# EAGLE board DotModuleArduinoMegaShield (EAGLE 9.1.3)
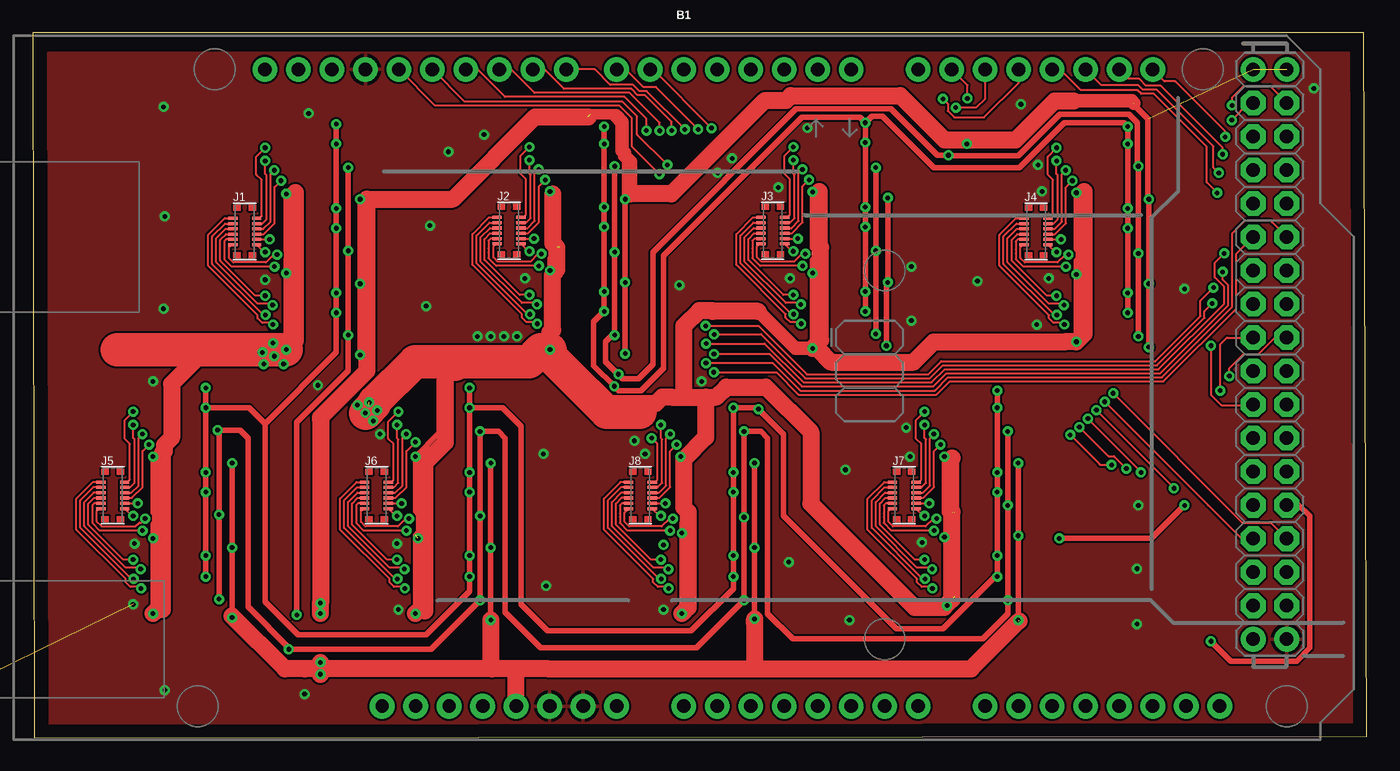
[diagram p2: board, top side]
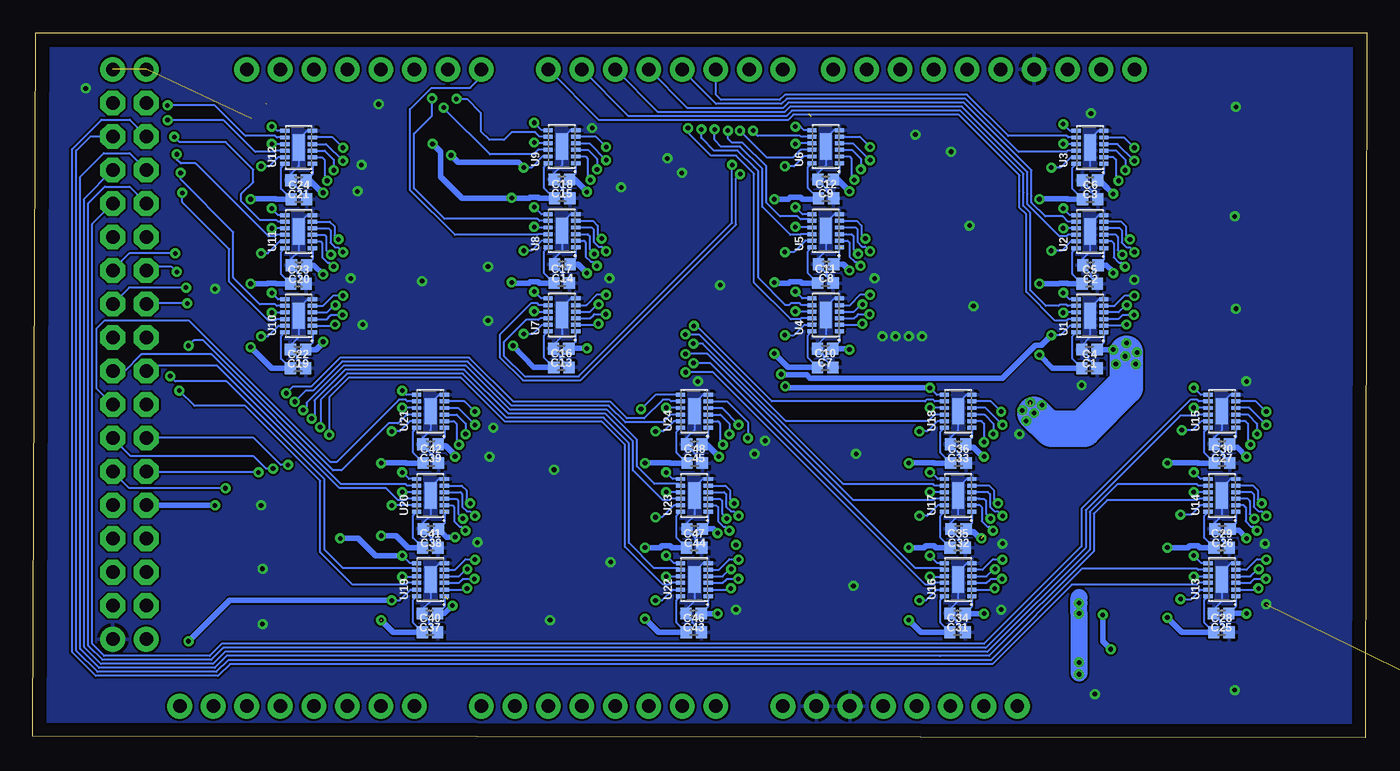
[diagram p3: board, bottom side, seen from below]

Size 101.1 x 53.4 mm. Coordinates in mm from the lower left corner, seen from the top.
Outline: 0.1,0 101.1,0.1 100.9,53.4 0,53.4 0.1,0
Copper layers (1*16): Top 0.035mm / dielectric 1.5mm / Bottom 0.035mm
Design rules "default": minimum track width 6mil, minimum drill 0.35mm, track to track 6mil, track to pad 6mil, pad to pad 6mil, via to via 6mil, smd to smd 6mil, copper to edge 40mil, drill to drill 6mil, minimum pad ring 10mil, minimum via ring 8mil, stop-mask expansion 4mil, vias tented up to drill 0mil, thermal gap 10mil

## Footprints (pad centres in the part's own frame; a part is rotated, then mirrored left to right if it is on the bottom)
ARDUINO_MEGA_NO_SILK = drill 1.016 pad 1.88: 0 13.97,24.13; 1 11.43,24.13; 2 8.89,24.13; 3 6.35,24.13; 3.3V -13.97,-24.13; 4 3.81,24.13; 5 1.27,24.13; 5V -11.43,-24.13; 5V@1 44.45,24.13; 5V@2 46.99,24.13; 6 -1.27,24.13; 7 -3.81,24.13; 8 -7.62,24.13; 9 -10.16,24.13; 10 -12.7,24.13; 11 -15.24,24.13; 12 -17.78,24.13; 13 -20.32,24.13; 14 19.05,24.13; 15 21.59,24.13; 16 24.13,24.13; 17 26.67,24.13; 18 29.21,24.13; 19 31.75,24.13; 20 34.29,24.13; 21 36.83,24.13; A0 1.27,-24.13; A1 3.81,-24.13; A2 6.35,-24.13; A3 8.89,-24.13; A4 11.43,-24.13; A5 13.97,-24.13; A6 16.51,-24.13; A7 19.05,-24.13; A8 24.13,-24.13; A9 26.67,-24.13; A10 29.21,-24.13; A11 31.75,-24.13; A12 34.29,-24.13; A13 36.83,-24.13; A14 39.37,-24.13; A15 41.91,-24.13; AREF -25.4,24.13; GND -8.89,-24.13; GND@1 -6.35,-24.13; GND@2 44.45,-19.05; GND@3 46.99,-19.05; GND@4 -22.86,24.13; IOREF -19.05,-24.13; NC -21.59,-24.13; RESET -16.51,-24.13; SCL -30.48,24.13; SDA -27.94,24.13; VIN -3.81,-24.13 | drill 1.016 pad 1.88 octagon: 22 44.45,21.59; 23 46.99,21.59; 24 44.45,19.05; 25 46.99,19.05; 26 44.45,16.51; 27 46.99,16.51; 28 44.45,13.97; 29 46.99,13.97; 30 44.45,11.43; 31 46.99,11.43; 32 44.45,8.89; 33 46.99,8.89; 34 44.45,6.35; 35 46.99,6.35; 36 44.45,3.81; 37 46.99,3.81; 38 44.45,1.27; 39 46.99,1.27; 40 44.45,-1.27; 41 46.99,-1.27; 42 44.45,-3.81; 43 46.99,-3.81; 44 44.45,-6.35; 45 46.99,-6.35; 46 44.45,-8.89; 47 46.99,-8.89; 48 44.45,-11.43; 49 46.99,-11.43; 50 44.45,-13.97; 51 46.99,-13.97; 52 44.45,-16.51; 53 46.99,-16.51
0402 = smd 0.85 x 0.9: 1 -0.58,0; 2 0.58,0
AXE612124-12PIN = smd 0.7 x 0.23: P1 -0.9,1; P2 -0.9,0.6; P3 -0.9,0.2; P4 -0.9,-0.2; P5 -0.9,-0.6; P6 -0.9,-1; P7 0.9,-1; P8 0.9,-0.6; P9 0.9,-0.2; P10 0.9,0.2; P11 0.9,0.6; P12 0.9,1
USB-B-MICRO-SMD_RED_PASTE = smd 1.45 x 0.4: D+ 2.725,0; D- 2.725,0.65; GND 2.725,-1.3; ID 2.725,-0.65; VBUS 2.725,1.3 | smd 1.5 x 1.8: SHIELD1 0,3.685; SHIELD2 0,-3.685 | smd 1.5 x 2.5: SHIELD3 0,0 | hole 0.85: 2.2,1.9; 2.2,-1.9
WSON-12 = smd 0.3 x 0.7: 1 -1.25,-1.05; 2 -0.75,-1.05; 3 -0.25,-1.05; 4 0.25,-1.05; 5 0.75,-1.05; 6 1.25,-1.05; 7 1.25,1.05; 8 0.75,1.05; 9 0.25,1.05; 10 -0.25,1.05; 11 -0.75,1.05; 12 -1.25,1.05 | smd 2 x 0.9: PAD 0,0

## Placement (x,y rotation side)
B1  ARDUINO_MEGA_R3FULL  [ARDUINO_MEGA_NO_SILK]  48.06,26.51 0 top
C1  0.1uF  [0402]  21.01,29.41 180 bottom
C2  0.1uF  [0402]  20.93,35.81 180 bottom
C3  0.1uF  [0402]  20.96,42.24 180 bottom
C4  0.1uF  [0402]  21,27.99 0 bottom
C5  0.1uF  [0402]  20.98,34.39 0 bottom
C6  0.1uF  [0402]  20.94,40.81 0 bottom
C7  0.1uF  [0402]  41.05,29.47 180 bottom
C8  0.1uF  [0402]  40.97,35.87 180 bottom
C9  0.1uF  [0402]  41,42.3 180 bottom
C10  0.1uF  [0402]  41.04,28.05 0 bottom
C11  0.1uF  [0402]  41.02,34.45 0 bottom
C12  0.1uF  [0402]  40.98,40.87 0 bottom
C13  0.1uF  [0402]  61.05,29.47 180 bottom
C14  0.1uF  [0402]  60.97,35.87 180 bottom
C15  0.1uF  [0402]  61,42.3 180 bottom
C16  0.1uF  [0402]  61.04,28.05 0 bottom
C17  0.1uF  [0402]  61.02,34.45 0 bottom
C18  0.1uF  [0402]  60.98,40.87 0 bottom
C19  0.1uF  [0402]  81.01,29.41 180 bottom
C20  0.1uF  [0402]  80.93,35.81 180 bottom
C21  0.1uF  [0402]  80.96,42.24 180 bottom
C22  0.1uF  [0402]  81,27.99 0 bottom
C23  0.1uF  [0402]  80.98,34.39 0 bottom
C24  0.1uF  [0402]  80.94,40.81 0 bottom
C25  0.1uF  [0402]  11.01,9.41 180 bottom
C26  0.1uF  [0402]  10.93,15.81 180 bottom
C27  0.1uF  [0402]  10.96,22.24 180 bottom
C28  0.1uF  [0402]  11,7.99 0 bottom
C29  0.1uF  [0402]  10.98,14.39 0 bottom
C30  0.1uF  [0402]  10.94,20.81 0 bottom
C31  0.1uF  [0402]  31.01,9.41 180 bottom
C32  0.1uF  [0402]  30.93,15.81 180 bottom
C33  0.1uF  [0402]  30.96,22.24 180 bottom
C34  0.1uF  [0402]  31,7.99 0 bottom
C35  0.1uF  [0402]  30.98,14.39 0 bottom
C36  0.1uF  [0402]  30.94,20.81 0 bottom
C37  0.1uF  [0402]  71.01,9.41 180 bottom
C38  0.1uF  [0402]  70.93,15.81 180 bottom
C39  0.1uF  [0402]  70.96,22.24 180 bottom
C40  0.1uF  [0402]  71,7.99 0 bottom
C41  0.1uF  [0402]  70.98,14.39 0 bottom
C42  0.1uF  [0402]  70.94,20.81 0 bottom
C43  0.1uF  [0402]  51.01,9.41 180 bottom
C44  0.1uF  [0402]  50.93,15.81 180 bottom
C45  0.1uF  [0402]  50.96,22.24 180 bottom
C46  0.1uF  [0402]  51,7.99 0 bottom
C47  0.1uF  [0402]  50.98,14.39 0 bottom
C48  0.1uF  [0402]  50.94,20.81 0 bottom
J1  AXE612124-12PIN  [AXE612124-12PIN]  16.05,38.36 0 top
J2  AXE612124-12PIN  [AXE612124-12PIN]  36.09,38.42 0 top
J3  AXE612124-12PIN  [AXE612124-12PIN]  56.09,38.42 0 top
J4  AXE612124-12PIN  [AXE612124-12PIN]  76.05,38.36 0 top
J5  AXE612124-12PIN  [AXE612124-12PIN]  6.05,18.36 0 top
J6  AXE612124-12PIN  [AXE612124-12PIN]  26.05,18.36 0 top
J7  AXE612124-12PIN  [AXE612124-12PIN]  66.05,18.36 0 top
J8  AXE612124-12PIN  [AXE612124-12PIN]  46.05,18.36 0 top
J9  [USB-B-MICRO-SMD_RED_PASTE]  -11.5,3.4 0 top  (outside the outline)
U1  DRV8835  [WSON-12]  20.96,31.97 90 bottom
U2  DRV8835  [WSON-12]  20.96,38.35 90 bottom
U3  DRV8835  [WSON-12]  20.96,44.73 90 bottom
U4  DRV8835  [WSON-12]  41,32.03 90 bottom
U5  DRV8835  [WSON-12]  41,38.41 90 bottom
U6  DRV8835  [WSON-12]  41,44.79 90 bottom
U7  DRV8835  [WSON-12]  61,32.03 90 bottom
U8  DRV8835  [WSON-12]  61,38.41 90 bottom
U9  DRV8835  [WSON-12]  61,44.79 90 bottom
U10  DRV8835  [WSON-12]  80.96,31.97 90 bottom
U11  DRV8835  [WSON-12]  80.96,38.35 90 bottom
U12  DRV8835  [WSON-12]  80.96,44.73 90 bottom
U13  DRV8835  [WSON-12]  10.96,11.97 90 bottom
U14  DRV8835  [WSON-12]  10.96,18.35 90 bottom
U15  DRV8835  [WSON-12]  10.96,24.73 90 bottom
U16  DRV8835  [WSON-12]  30.96,11.97 90 bottom
U17  DRV8835  [WSON-12]  30.96,18.35 90 bottom
U18  DRV8835  [WSON-12]  30.96,24.73 90 bottom
U19  DRV8835  [WSON-12]  70.96,11.97 90 bottom
U20  DRV8835  [WSON-12]  70.96,18.35 90 bottom
U21  DRV8835  [WSON-12]  70.96,24.73 90 bottom
U22  DRV8835  [WSON-12]  50.96,11.97 90 bottom
U23  DRV8835  [WSON-12]  50.96,18.35 90 bottom
U24  DRV8835  [WSON-12]  50.96,24.73 90 bottom

## Tracks (layer width: path | path; a pad name or v marks a point on that pad's centre or on a via)
D1.1
  Bottom 0.152: U1.10 22.62,31.72 22.75,31.59 23.62,31.59 25.8,33.77 25.8,39.65 26.32,40.17 26.32,41.43 26.31,41.44 26.31,42.6 30.92,47.21 43.45,47.21 43.86,46.8 58.19,46.8 B1.0
D1.2
  Bottom 0.152: U1.8 22.66,32.72 22.75,32.81 23.25,32.81 23.34,32.72 24.32,32.72 25.5,33.9 25.5,39.78 26.02,40.3 26.02,41.3 26.01,41.31 26.01,42.73 30.8,47.51 43.58,47.51 43.98,47.1 55.95,47.1 B1.1
D1.3
  Bottom 0.152: U2.10 22.64,38.1 22.75,37.99 23.28,37.99 25.71,40.42 25.71,41.18 25.71,42.85 30.67,47.82 43.7,47.82 44.11,47.41 53.72,47.41 B1.2
D1.4
  Bottom 0.152: U2.8 22.64,39.1 23.04,39.49 24.35,39.49 25.41,40.55 25.41,41.05 25.4,41.06 25.4,42.98 30.54,48.12 43.83,48.12 44.24,47.71 51.48,47.71 B1.3
D1.5
  Bottom 0.152: U3.10 22.66,44.48 22.75,44.39 26.38,44.39 30.42,48.43 43.96,48.43 44.36,48.02 49.3,48.02 51.87,50.59 B1.4
D1.6
  Bottom 0.152: U3.8 22.62,45.48 22.75,45.61 27.17,45.61 30.29,48.73 44.08,48.73 44.49,48.32 48.92,48.32 49.33,48.73 B1.5
D2.1  (via drill 0.35)
  Top 0.152: v51.44,46.19 47,50.64 B1.6
  Bottom 0.152: U4.10 42.86,31.78 42.95,31.69 43.65,31.69 46.42,34.46 46.42,42.72 47.8,44.1 49.69,44.1 51.44,45.85 v51.44,46.19
D2.2  (via drill 0.35)
  Top 0.152: B1.7 44.25,50.63 44.97,50.63 46.3,49.3 47.23,49.3 v50.44,46.1
  Bottom 0.152: U4.8 42.82,32.78 42.95,32.91 43.65,32.91 43.78,32.78 44.04,32.78 46.12,34.86 46.12,42.92 46.42,43.22 47.69,44.49 49.48,44.49 50.44,45.44 v50.44,46.1
D2.3  (via drill 0.35)
  Top 0.152: B1.8 42.6,50.64 43.77,49.47 45.5,49.47 45.98,48.99 46.53,48.99 v49.43,46.09
  Bottom 0.152: U5.10 42.88,38.16 42.95,38.09 43.68,38.09 45.81,40.22 45.81,43.11 47.49,44.79 48.93,44.79 49.43,45.29 v49.43,46.09
D2.4  (via drill 0.35)
  Top 0.152: B1.9 38.79,50.64 40.26,49.17 45.37,49.17 45.85,48.69 46.4,48.69 48.42,46.67 v48.42,46 48.42,46.12
  Bottom 0.152: U5.8 42.17,39.28 42.91,39.28 43.12,39.49 44.45,39.49 45.51,40.55 45.51,43.29 47.32,45.1 48.12,45.1 48.42,45.4 v48.42,46
D2.5  (via drill 0.35)
  Top 0.152: v47.51,45.99 47.51,46.6 45.25,48.86 38.03,48.86 36.25,50.64 B1.10
  Bottom 0.152: U6.10 42.9,44.54 43.45,43.99 45.51,43.99 v47.51,45.99
D2.6  (via drill 0.35)
  Top 0.152: 32.86,50.64 B1.11 33.71,50.64 35.79,48.56 44.84,48.56 46.5,46.9 v46.5,46
  Bottom 0.152: U6.8 42.88,45.54 42.95,45.61 46.17,45.61 46.5,45.94 v46.5,46
D3.1  (via drill 0.35)
  Top 0.152: v48.1,43.4 45.81,45.69 45.81,47.08 44.68,48.2 32.72,48.2 B1.12
  Bottom 0.152: v48.1,43.4 48.1,39 59.73,27.37 63.83,27.37 65.41,28.95 65.41,29.95 63.7,31.66 62.77,31.66 62.65,31.78 U7.10
D3.2  (via drill 0.35)
  Top 0.152: v47.49,42.7 45.41,44.79 45.41,46.95 44.46,47.9 30.48,47.9 B1.13
  Bottom 0.152: v47.49,42.7 47.8,42.4 47.8,38.87 59.6,27.07 63.96,27.07 65.71,28.82 65.71,30.55 63.35,32.91 62.85,32.91 62.72,32.78 U7.8
D3.3
  Bottom 0.152: U8.10 62.78,38.16 62.85,38.09 69.11,38.09 72.52,41.5 72.52,47.63 70.89,49.25 67.95,49.25 67.11,50.09 B1.14
D3.4  (via drill 0.35)
  Top 0.152: B1.15 70.84,49.45 v70.84,48.44
  Bottom 0.152: U8.8 62.7,39.16 62.85,39.31 69.9,39.31 72.21,41.62 72.21,45.78 70.84,47.15 v70.84,48.44
D3.5  (via drill 0.35)
  Top 0.152: B1.16 72.19,48.43 71.49,47.74 v69.96,47.74
  Bottom 0.152: U9.10 62.8,44.54 63.15,44.19 66.45,44.19 69.86,47.6 69.86,47.64 v69.96,47.74
D3.6  (via drill 0.35)
  Top 0.152: B1.17 74.73,49.63 72.1,47 69.84,47 69.35,47.49 69.35,48.05 v69,48.4
  Bottom 0.152: U9.8 62.68,45.54 63.04,45.89 64.81,45.89 65.4,45.3 66.5,45.3 67.15,45.95 | 67.15,45.95 67.09,45.89 | 67.15,45.95 67.15,47.35 68.2,48.4 v69,48.4
D4.1  (via drill 0.35)
  Top 0.152: B1.18 77.86,50.64 79.43,49.07 83.72,49.07 84.01,48.78 84.98,48.78 88.98,44.78 88.98,42.08 v89.78,41.28
  Bottom 0.152: U10.10 82.62,31.72 82.75,31.59 83.25,31.59 86.21,34.56 86.21,37.01 89.78,40.58 v89.78,41.28
D4.2  (via drill 0.35)
  Top 0.152: v89.9,42.8 89.5,43.2 89.5,44.8 85.2,49.1 84.13,49.1 83.8,49.44 81.01,49.44 B1.19
  Bottom 0.152: U10.8 82.61,32.72 82.73,32.84 83.9,32.84 85.91,34.85 85.91,38.31 89.9,42.3 v89.9,42.8
D4.3  (via drill 0.35)
  Top 0.152: v90.2,44.21 90.2,44.71 85.5,49.41 84.39,49.41 83.86,49.94 83.05,49.94 B1.20
  Bottom 0.152: U11.10 82.64,38.1 82.75,37.99 83.25,37.99 88.77,43.51 89.9,43.51 90.2,43.81 v90.2,44.21
D4.4  (via drill 0.35)
  Top 0.152: v90.38,45.52 90.38,45.95 86.59,49.74 85.79,49.74 B1.21
  Bottom 0.152: U11.8 82.51,39.1 82.63,39.22 83.88,39.22 85.3,40.64 85.3,41.2 84.4,42.1 84.4,43.04 86.48,45.12 89.98,45.12 v90.38,45.52
D4.5  (via drill 0.35)
  Top 0.152: v90.89,46.8 92.19,48.1 B1.22
  Bottom 0.152: U12.10 82.66,44.48 82.75,44.39 84.25,44.39 86.66,46.8 v90.89,46.8
D4.6  (via drill 0.35)
  Top 0.152: B1.23 93.75,49.4 91.8,49.4 90.9,48.5 v90.9,47.91
  Bottom 0.152: U12.8 82.62,45.48 82.75,45.61 85.01,45.61 87.31,47.91 v90.9,47.91
D5.1
  Bottom 0.152: U13.10 12.72,11.72 12.85,11.59 22.35,11.59 28.37,5.58 86.17,5.58 87.07,4.68 96.33,4.68 98.13,6.47 98.13,44.6 95.9,46.83 93.77,46.83 92.51,45.57 B1.24
D5.2
  Bottom 0.152: U13.8 12.76,12.72 12.85,12.81 21.57,12.81 28.5,5.88 86.29,5.88 87.19,4.98 96.21,4.98 97.82,6.6 97.82,44.48 96.74,45.56 B1.25
D5.3
  Bottom 0.152: U14.10 12.74,18.1 12.85,17.99 19.67,17.99 20.69,16.97 20.69,14.12 28.62,6.19 32.3,6.19 | 32.3,6.19 32.4,6.19 | 32.3,6.19 86.42,6.19 87.32,5.29 96.08,5.29 97.52,6.73 97.52,42.5 95.73,44.29 93.78,44.29 B1.26
D5.4
  Bottom 0.152: U14.8 12.74,19.1 12.85,19.21 18.88,19.21 20.99,17.1 20.99,14.25 28.75,6.49 86.55,6.49 87.45,5.59 95.95,5.59 97.21,6.85 97.21,40.86 B1.27
D5.5
  Bottom 0.152: U15.10 12.76,24.48 12.85,24.39 14.13,24.39 21.3,17.23 21.3,14.37 28.87,6.79 86.67,6.79 87.57,5.89 95.83,5.89 96.91,6.98 96.91,40.49 95.65,41.75 93.78,41.75 B1.28
D5.6
  Bottom 0.152: U15.8 12.72,25.48 12.85,25.61 13.35,25.61 21.6,17.36 21.6,14.5 29,7.1 86.8,7.1 87.7,6.2 95.7,6.2 96.6,7.11 96.6,38.92 B1.29
D6.1  (via drill 0.35)
  Top 0.152: v51.61,27.69 56.36,27.69 58.05,26 68.5,26 69.5,27 85.71,27 91.22,32.51 91.22,36.65 B1.30
  Bottom 0.152: U16.10 32.72,11.72 32.85,11.59 33.45,11.59 49.55,27.69 v51.61,27.69
D6.2  (via drill 0.35)
  Top 0.152: v51.02,28.38 51.02,28.39 56.08,28.39 58.17,26.3 68.37,26.3 69.37,27.3 85.59,27.3 90.92,32.64 90.92,38.22 91.9,39.2 93.79,39.2 93.94,39.05 | 93.88,39.11 93.94,39.05 | 93.94,39.05 B1.31
  Bottom 0.152: U16.8 32.13,12.84 34.2,12.84 49.74,28.38 v51.02,28.38
D6.3  (via drill 0.35)
  Top 0.152: v51.63,29.07 51.63,29.09 55.82,29.09 58.3,26.61 68.25,26.61 69.25,27.61 85.46,27.61 90.61,32.76 90.61,34.29 90.2,34.7 v90.2,35.3
  Bottom 0.152: U17.10 32.74,18.1 32.85,17.99 38.89,17.99 49.97,29.07 v51.63,29.07 | v90.2,35.3 90.6,35.7 92.21,35.7 B1.32
D6.4  (via drill 0.35)
  Top 0.152: v90.31,36.7 89.59,35.98 89.59,34.88 90.31,34.16 90.31,32.89 85.34,27.91 69.12,27.91 68.12,26.91 58.42,26.91 55.47,29.86 v51.04,29.86
  Bottom 0.152: U17.8 32.74,19.1 32.85,19.21 39.67,19.21 50.33,29.86 v51.04,29.86 | v90.31,36.7 93.8,36.7 95.05,35.45 B1.33
D6.5  (via drill 0.35)
  Top 0.152: v51.64,30.56 51.64,30.57 55.2,30.57 57.38,28.38 58.55,27.22 68,27.22 69,28.22 85.21,28.22 88.81,31.82 88.81,32.3 v89.4,32.9
  Bottom 0.152: U18.10 32.76,24.48 33.25,23.99 44.02,23.99 50.59,30.56 v51.64,30.56 | v89.4,32.9 92.47,32.9 B1.34
D6.6  (via drill 0.35)
  Top 0.152: v51,31.2 55,31.2 58.68,27.52 67.87,27.52 68.87,28.52 85.08,28.52 88.5,31.94 88.5,33.1 v89.5,34.1
  Bottom 0.152: U18.8 32.72,25.48 32.85,25.61 33.35,25.61 33.48,25.48 45.08,25.48 50.8,31.2 v51,31.2 | B1.35 93.81,34.1 v89.5,34.1
D7.1  (via drill 0.35)
  Top 0.152: v90,26.3 90,29.81 90.51,30.32 B1.36
  Bottom 0.152: U19.10 72.72,11.72 72.85,11.59 76.85,11.59 79.31,14.05 79.31,19.46 85,25.14 88.84,25.14 v90,26.3
D7.2  (via drill 0.35)
  Top 0.152: B1.37 94.16,30.32 92.89,29.05 91.75,29.05 90.7,28 v90.7,27.4
  Bottom 0.152: U19.8 72.13,12.84 77.6,12.84 79.01,14.25 79.01,19.58 86.42,27 90.3,27 v90.7,27.4
D7.3
  Bottom 0.152: U20.10 72.74,18.1 72.85,17.99 73.44,17.99 74.34,18.9 77.85,18.9 87.15,28.2 92.1,28.2 B1.38
D7.4
  Bottom 0.152: U20.8 72.74,19.1 72.85,19.21 77.73,19.21 87.57,29.05 92.89,29.05 94.16,27.78 B1.39
D7.5  (via drill 0.35)
  Top 0.152: B1.40 92.47,25.2 90.1,25.2 89.3,26 v89.3,29.7
  Bottom 0.152: U21.10 72.76,24.48 73.44,23.81 74.15,23.81 77.7,20.25 78.34,20.25 81.88,23.79 88.19,30.1 88.9,30.1 v89.3,29.7
D7.6
  Bottom 0.152: U21.8 72.72,25.48 72.85,25.61 73.35,25.61 78.08,20.88 78.54,20.88 89.25,31.59 95.71,31.59 96.3,31 96.3,26.49 B1.41
D8.1  (via drill 0.35)
  Top 0.152: v81.76,20.66 80.91,20.66 80.83,20.75 v78.64,22.94
  Bottom 0.152: U22.10 52.72,11.72 52.85,11.59 53.35,11.59 56.22,14.46 56.22,22.2 57.96,23.94 65.31,23.94 68.65,27.28 77.17,27.28 78.64,25.81 | 78.64,25.81 | 78.64,25.81 v78.64,22.94 | v81.76,20.66 82.31,20.66 84.38,22.73 92.48,22.73 B1.42
D8.2  (via drill 0.35)
  Top 0.152: v82.89,20.39 81.96,21.33 81.53,21.33 v79.33,23.53
  Bottom 0.152: U22.8 52.13,12.84 54,12.84 55.92,14.76 55.92,22.32 57.84,24.24 65.19,24.24 68.53,27.58 77.3,27.58 79.29,25.59 79.29,23.57 v79.33,23.53 | v82.89,20.39 83.44,20.39 84.37,21.33 93.68,21.33 B1.43
D8.3  (via drill 0.35)
  Top 0.152: v79.97,24.17 84,20.14 v84,20.1
  Bottom 0.152: U23.10 52.74,18.1 52.85,17.99 53.35,17.99 55.61,20.25 55.61,22.45 57.71,24.55 65.06,24.55 68.4,27.89 77.42,27.89 79.75,25.55 79.75,24.39 v79.97,24.17 | v84,20.1 92.45,20.1 B1.44
D8.4  (via drill 0.35)
  Top 0.152: v80.62,24.81 86.5,18.93 v86.5,18.9
  Bottom 0.152: U23.8 52.13,19.22 53.98,19.22 55.31,20.55 55.31,22.58 57.58,24.85 64.94,24.85 68.27,28.19 77.55,28.19 80.37,25.37 80.37,25.06 v80.62,24.81 | v86.5,18.9 93.79,18.9 B1.45
D8.5  (via drill 0.35)
  Top 0.152: v81.26,25.46 89.1,17.61 | 89.1,17.61 89.1,17.6 | 89.1,17.61 91.63,15.08 B1.48
  Bottom 0.152: U24.10 52.76,24.48 53.35,23.89 56.19,23.89 57.46,25.16 64.81,25.16 68.15,28.49 77.67,28.49 79.87,26.29 80.42,26.29 v81.26,25.46
D8.6  (via drill 0.35)
  Top 0.152: v81.9,26.1 91.7,16.3 93.83,16.3 B1.49
  Bottom 0.152: U24.8 52.72,25.48 52.85,25.61 53.35,25.61 54.76,24.2 56.07,24.2 57.33,25.46 64.68,25.46 68.02,28.8 77.8,28.8 80,26.6 81.4,26.6 v81.9,26.1
EN  (via drill 0.35)
  Top 0.406: v23,46.5 v23,45 v23,40.1 v23,38.6 v23,33.7 v23,32.2 23,29.2 17.6,23.8 | v13.1,26.5 v13.1,25 | v13.1,25 v13.1,20.1 v13.1,18.6 v13.1,13.8 v13.1,12.2 | v33.1,26.5 v33.1,25 | v33.1,25 v33.1,20.1 v33.1,18.6 v33.1,13.8 v33.1,12.2 33.1,11.1 29.8,7.8 20.1,7.8 17.6,10.3 17.6,23.8 | v43.3,46.3 v43.3,45 v43.3,40.2 v43.3,38.7 v43.3,33.8 v43.3,32.3 42.5,31.5 42.5,28.2 v44.07,26.63 44.4,26.3 46.1,26.3 47.8,28 47.8,36.5 58.3,47 62.7,47 v63.1,46.6 | v63.1,46.6 v63.1,45.1 v63.1,40.2 v63.1,38.7 v63.1,33.8 v63.1,32.3 | v73.1,26.3 v73.1,25 v73.1,20.1 v73.1,18.6 v73.1,13.8 v73.1,12.2 72.94,12.2 68.98,8.24 65.46,8.24 56.9,16.8 56.9,23 v55,24.9 54.9,25 v53.1,25 v53.1,20.1 v53.1,18.6 v53.1,13.8 v53.1,12.2 53.1,11.3 49.9,8.1 39,8.1 37,10.1 37,23.6 35.6,25 v33.1,25 | v83,32.2 v83,33.7 v83,38.6 v83,40.1 v83,45 v83,46.3 82.7,46.6 78.2,46.6 74.8,43.2 68.3,43.2 64.4,47.1 63.6,47.1 v63.1,46.6 | 17.6,23.8 16.4,25 v13.1,25 | v77.8,15.1 84.8,15.1 v87.3,17.6
  Bottom 0.152: U3.7 22.48,45.98 v23,46.5 | U3.9 22.98,44.98 v23,45 | U2.7 22.5,39.6 v23,40.1 | U2.9 v23,38.6 | U1.7 22.52,33.22 v23,33.7 | U1.9 22.98,32.22 v23,32.2 | U15.7 12.58,25.98 v13.1,26.5 | v13.1,12.2 13.08,12.22 U13.9 | U13.7 12.52,13.22 v13.1,13.8 | U14.7 12.6,19.6 v13.1,20.1 | U14.9 v13.1,18.6 | U15.9 13.08,24.98 v13.1,25 | U18.7 32.58,25.98 v33.1,26.5 | v33.1,12.2 32.03,12.2 U16.9 | U16.7 32.52,13.22 v33.1,13.8 | v33.1,20.1 33.01,20.1 32.51,19.6 U17.7 | U17.9 v33.1,18.6 | U18.9 33.08,24.98 v33.1,25 | U6.7 42.64,46.04 42.9,46.3 v43.3,46.3 | v43.3,32.3 42.07,32.3 U4.9 | U4.7 42.78,33.28 v43.3,33.8 | U5.7 42.76,39.66 v43.3,40.2 | U6.9 43.26,45.04 v43.3,45 | U5.9 43.26,38.66 v43.3,38.7 | U24.7 53.92,25.98 v55,24.9 | v53.1,12.2 53.08,12.22 U22.9 | U22.7 52.52,13.22 v53.1,13.8 | U23.9 v53.1,18.6 | U23.7 52.6,19.6 v53.1,20.1 | U24.9 53.08,24.98 v53.1,25 | U9.7 62.54,46.04 v63.1,46.6 | v63.1,38.7 63.06,38.66 U8.9 | U8.7 62.56,39.66 v63.1,40.2 | U9.9 63.04,45.04 v63.1,45.1 | v63.1,32.3 63.08,32.28 U7.9 | U7.7 62.58,33.28 v63.1,33.8 | U21.7 72.78,25.98 v73.1,26.3 | v73.1,12.2 72.03,12.2 U19.9 | U19.7 72.52,13.22 v73.1,13.8 | U20.9 v73.1,18.6 | U20.7 72.6,19.6 v73.1,20.1 | U21.9 73.08,24.98 v73.1,25 | U12.7 82.58,45.98 82.9,46.3 v83,46.3 | v83,32.2 82.98,32.22 U10.9 | U10.7 82.52,33.22 v83,33.7 | U11.7 82.5,39.6 v83,40.1 | U11.9 v83,38.6 | U12.9 82.98,44.98 v83,45
  Bottom 0.406: v33.1,26.5 43.84,26.5 43.97,26.63 v44.07,26.63 | v73.1,13.8 75.14,13.8 76.44,15.1 v77.8,15.1 | v87.3,17.6 92.49,17.6 B1.46
GND  (via drill 0.35)  (1 unrouted)
  Bottom 0.152: U6.6 40.36,46.04 41,45.4 U6.PAD 41,43.37 41.58,42.79 C9.2 41.58,42.22 40.91,41.54 40.91,41.38 C12.2 | U5.6 40.34,39.66 41,39 U5.PAD 41,36.89 41.55,36.34 C8.2 41.55,35.8 40.95,35.2 40.95,34.96 C11.2 | 40.85,32.76 40.85,32.55 | 40.85,32.76 40.85,32.18 U4.PAD 41,30.4 41.63,29.77 C7.2 41.12,28.96 41.12,28.76 40.46,28.1 C10.2 | 40,33.33 U4.6 40.33,33.28 40.85,32.76 | U24.6 50.32,25.98 50.96,25.34 U24.PAD 50.96,23.31 51.54,22.73 C45.2 51.54,22.16 50.87,21.48 50.87,21.32 C48.2 | U23.6 50.3,19.6 50.96,18.94 U23.PAD 50.96,16.83 51.51,16.28 C44.2 51.51,15.74 50.91,15.13 50.91,14.9 C47.2 | 50.81,12.7 50.81,12.49 | 50.81,12.7 50.81,12.12 U22.PAD 50.96,10.34 51.59,9.71 C43.2 51.08,8.9 51.08,8.7 50.42,8.04 C46.2 | 49.96,13.27 U22.6 50.29,13.22 50.81,12.7 | U3.6 20.32,45.98 20.96,45.34 U3.PAD 20.96,43.31 | U2.6 20.3,39.6 20.96,38.94 U2.PAD 20.96,36.83 21.51,36.28 C2.2 21.51,35.74 20.91,35.13 20.91,34.9 C5.2 | C6.2 20.87,41.32 20.87,41.48 21.54,42.16 C3.2 | 20.81,32.7 20.81,32.49 | 20.81,32.7 20.81,32.12 U1.PAD 20.96,30.34 21.59,29.71 C1.2 21.08,28.9 21.08,28.7 20.42,28.04 C4.2 | 19.96,33.27 U1.6 20.29,33.22 20.81,32.7 | U9.6 60.36,46.04 61,45.4 U9.PAD 61,43.37 61.58,42.79 C15.2 61.58,42.22 60.91,41.54 60.91,41.38 C18.2 | U8.6 60.34,39.66 61,39 U8.PAD 61,36.89 61.55,36.34 C14.2 61.55,35.8 60.95,35.2 60.95,34.96 C17.2 | 60.85,32.76 60.85,32.55 | 60.85,32.76 60.85,32.18 U7.PAD 61,30.4 61.63,29.77 C13.2 61.12,28.96 61.12,28.76 60.46,28.1 C16.2 | 60,33.33 U7.6 60.33,33.28 60.85,32.76 | U12.6 80.32,45.98 80.96,45.34 U12.PAD 80.96,43.31 81.54,42.73 C21.2 81.54,42.16 80.87,41.48 80.87,41.32 C24.2
  Bottom 0.152: U11.6 80.3,39.6 80.96,38.94 U11.PAD 80.96,36.83 81.51,36.28 C20.2 81.51,35.74 80.91,35.13 80.91,34.9 C23.2 | 80.81,32.7 80.81,32.49 | 80.81,32.7 80.81,32.12 U10.PAD 80.96,30.34 81.59,29.71 C19.2 81.08,28.9 81.08,28.7 80.42,28.04 C22.2 | 79.96,33.27 U10.6 80.29,33.22 80.81,32.7 | U15.6 10.32,25.98 10.96,25.34 U15.PAD 10.96,23.31 11.54,22.73 C27.2 11.54,22.16 10.87,21.48 10.87,21.32 C30.2 | U14.6 10.3,19.6 10.96,18.94 U14.PAD 10.96,16.83 11.51,16.28 C26.2 11.51,15.74 10.91,15.13 10.91,14.9 C29.2 | 10.81,12.7 10.81,12.49 | 10.81,12.7 10.81,12.12 U13.PAD 10.96,10.34 11.59,9.71 C25.2 11.08,8.9 11.08,8.7 10.42,8.04 C28.2 | 9.96,13.27 U13.6 10.29,13.22 10.81,12.7 | U18.6 30.32,25.98 30.96,25.34 U18.PAD 30.96,23.31 31.54,22.73 C33.2 31.54,22.16 30.87,21.48 30.87,21.32 C36.2 | U17.6 30.3,19.6 30.96,18.94 U17.PAD 30.96,16.83 31.51,16.28 C32.2 31.51,15.74 30.91,15.13 30.91,14.9 C35.2 | 30.81,12.7 30.81,12.49 | 30.81,12.7 30.81,12.12 U16.PAD 30.96,10.34 31.59,9.71 C31.2 31.08,8.9 31.08,8.7 30.42,8.04 C34.2 | 29.96,13.27 U16.6 30.29,13.22 30.81,12.7 | U21.6 70.32,25.98 70.96,25.34 U21.PAD 70.96,23.31 71.54,22.73 C39.2 71.54,22.16 70.87,21.48 70.87,21.32 C42.2 | U20.6 70.3,19.6 70.96,18.94 U20.PAD 70.96,16.83 71.51,16.28 C38.2 71.51,15.74 70.91,15.13 70.91,14.9 C41.2 | 70.81,12.7 70.81,12.49 | 70.81,12.7 70.81,12.12 U19.PAD 70.96,10.34 71.59,9.71 C37.2 71.08,8.9 71.08,8.69 70.93,8.54 70.93,8.5 C40.2 | U19.6 70.29,13.22 70.81,12.7
  other vias: 50.7,27 34.2,45.7 36.7,30.4 35.7,30.4 34.7,30.4 33.7,30.4 49,34.3 57.4,34.8 56.5,41.7 58.7,46.2 53,43.9 51.9,42.8 26.3,23 27.6,14.7 27.7,9.7 9.1,27 7.6,10.1 7.7,14.7 46.4,21.5 45.6,22.5 47.8,9.7 38.9,11.5 37.3,34.8 66.2,23.5 66.5,21.3 67.4,14.8 61.9,8.9 57.3,13.3 76.2,43.4 76.5,41.4 77,34.8 76.1,31.3 66.6,31.6 66.6,35.7 20.9,47.3 17.6,34.7 21.6,26.7 9.9,32.5 10,39.5 9.9,47.8 10,3.6 20.6,3.3 83.7,8.6 83.7,12.8 83.8,17.6 30.1,38.8 29.8,32.7 74.9,48 71.6,34.6 31.5,44.4 61.6,20.3 97.1,49.2 87.3,34 38.7,21.5
  pour Bottom: 1.1,52.4 1.1,1.1 100.1,1.1 100.1,52.4
  pour Top: 1.1,51.9 1.1,0.4 100.1,0.4 100.1,51.9
J1P1  (via drill 0.35)
  Top 0.152: v18.19,31.31 18.08,31.42 17.38,31.42 17.02,31.78 17.02,32.02 13.28,35.77 13.28,38.1 14.54,39.36 J1.P1
  Bottom 0.152: v18.19,31.31 18.28,31.22 U1.2
J1P2  (via drill 0.35)
  Top 0.152: J1.P2 14.57,38.96 13.59,37.98 13.59,35.89 17.45,32.03 v17.63,32.03
  Bottom 0.152: v17.63,32.03 18.49,32.03 18.8,31.72 U1.3
J1P3  (via drill 0.35)
  Top 0.152: v18.17,32.77 18.06,32.88 17.03,32.88 13.89,36.02 13.89,37.85 14.6,38.56 J1.P3
  Bottom 0.152: v18.17,32.77 18.26,32.77 18.81,32.22 U1.4
J1P4  (via drill 0.35)
  Top 0.152: J1.P4 14.63,38.16 14.2,37.73 14.2,36.14 16.85,33.49 v17.6,33.49
  Bottom 0.152: v17.6,33.49 17.63,33.52 18.31,33.52 19.11,32.72 U1.5
J1P5  (via drill 0.35)
  Top 0.152: v18.31,35.69 15.08,35.69 14.5,36.27 14.5,36.7 14.5,37 14.5,37.6 14.66,37.76 J1.P5
  Bottom 0.152: v18.31,35.69 18.61,36 18.76,36 19.16,36.4 19.16,37.46 19.3,37.6 U2.2
J1P6  (via drill 0.35)
  Top 0.152: v18.51,36.6 18.26,36.6 17.67,36.01 15.2,36.01 14.86,36.34 14.86,37.17 15.05,37.36 J1.P6
  Bottom 0.152: v18.51,36.6 18.86,36.95 18.86,37.9 18.86,37.96 19,38.1 U2.3
J1P7  (via drill 0.35)
  Top 0.152: J1.P7 17.51,36.8 v17.6,36.8
  Bottom 0.152: v17.6,36.8 17.95,37.15 18.2,37.15 18.55,37.5 18.55,38.45 18.7,38.6 U2.4
J1P8  (via drill 0.35)
  Top 0.152: J1.P8 v17.94,37.76 v17.95,37.75
  Bottom 0.152: v17.95,37.75 18.25,38.05 18.25,38.74 18.6,39.1 U2.5
J1P9  (via drill 0.35)
  Top 0.152: v18.8,42.2 18.31,41.71 18.31,38.98 17.49,38.16 J1.P9
  Bottom 0.152: v18.8,42.2 19,42.4 19,43.8 19.18,43.98 U3.2
J1P10  (via drill 0.35)
  Top 0.152: J1.P10 17.46,38.56 18.01,39.1 18.01,42.7 v18.3,43
  Bottom 0.152: v18.3,43 18.3,43.8 18.98,44.48 U3.3
J1P11  (via drill 0.35)
  Top 0.152: J1.P11 17.36,38.96 17.7,39.3 17.7,42.6 17.6,42.7 v17.6,43.7
  Bottom 0.152: v17.6,43.7 18.88,44.98 U3.4
J1P12  (via drill 0.35)
  Top 0.152: v17.6,44.7 16.94,44.04 16.94,42.66 17.34,42.26 17.34,39.55 17.15,39.36 J1.P12
  Bottom 0.152: v17.6,44.7 18.38,45.48 U3.5
J2P1  (via drill 0.35)
  Top 0.152: v38.23,31.37 38.12,31.48 37.42,31.48 37.06,31.84 37.06,32.09 33.32,35.83 33.32,38.16 34.58,39.42 J2.P1
  Bottom 0.152: U4.2 38.23,31.28 v38.23,31.37
J2P2  (via drill 0.35)
  Top 0.152: J2.P2 34.61,39.02 33.63,38.04 33.63,35.95 37.49,32.09 v37.67,32.09
  Bottom 0.152: U4.3 38.85,31.78 38.61,32.02 38.6,32.02 38.53,32.09 v37.67,32.09
J2P3  (via drill 0.35)
  Top 0.152: v38.21,32.83 38.1,32.94 37.07,32.94 33.93,36.08 33.93,37.91 34.64,38.62 J2.P3
  Bottom 0.152: U4.4 38.85,32.28 38.3,32.83 v38.21,32.83
J2P4  (via drill 0.35)
  Top 0.152: J2.P4 34.67,38.22 34.23,37.79 34.23,36.2 36.89,33.55 v37.64,33.55
  Bottom 0.152: v37.64,33.55 37.67,33.58 38.35,33.58 39.15,32.78 U4.5
J2P5  (via drill 0.35)
  Top 0.152: v38.35,35.75 35.12,35.75 34.54,36.33 34.54,36.76 34.54,37.06 34.54,37.66 34.7,37.82 J2.P5
  Bottom 0.152: U5.2 39.34,37.66 39.2,37.52 39.2,36.46 38.8,36.06 38.65,36.06 v38.35,35.75
J2P6  (via drill 0.35)
  Top 0.152: v38.55,36.66 38.3,36.66 37.7,36.07 35.23,36.07 34.9,36.4 34.9,37.23 35.09,37.42 J2.P6
  Bottom 0.152: U5.3 39.44,38.16 39.04,38.16 38.9,38.02 38.9,37.96 38.9,37.01 v38.55,36.66
J2P7  (via drill 0.35)
  Top 0.152: J2.P7 37.55,36.86 v37.64,36.86
  Bottom 0.152: U5.4 38.74,38.66 38.59,38.51 38.59,37.56 38.24,37.21 37.99,37.21 v37.64,36.86
J2P8  (via drill 0.35)
  Top 0.152: J2.P8 v37.98,37.82 v37.98,37.81
  Bottom 0.152: U5.5 38.64,39.16 38.28,38.8 38.28,38.12 v37.98,37.81
J2P9  (via drill 0.35)
  Top 0.152: v38.84,42.26 38.35,41.77 38.35,39.04 37.53,38.22 J2.P9
  Bottom 0.152: U6.2 39.22,44.04 39.04,43.86 39.04,42.46 v38.84,42.26
J2P10  (via drill 0.35)
  Top 0.152: J2.P10 37.5,38.62 38.05,39.16 38.05,42.77 v38.34,43.06
  Bottom 0.152: U6.3 39.02,44.54 38.34,43.86 v38.34,43.06
J2P11  (via drill 0.35)
  Top 0.152: J2.P11 37.4,39.02 37.74,39.36 37.74,42.66 37.64,42.76 v37.64,43.76
  Bottom 0.152: v37.64,43.76 38.92,45.04 U6.4
J2P12  (via drill 0.35)
  Top 0.152: v37.64,44.76 36.98,44.1 36.98,42.72 37.38,42.32 37.38,39.61 37.19,39.42 J2.P12
  Bottom 0.152: U6.5 39.54,45.54 38.42,45.54 v37.64,44.76
J3P1  (via drill 0.35)
  Top 0.152: v58.23,31.37 58.12,31.48 57.42,31.48 57.06,31.84 57.06,32.09 53.32,35.83 53.32,38.16 54.58,39.42 J3.P1
  Bottom 0.152: U7.2 58.32,31.28 v58.23,31.37
J3P2  (via drill 0.35)
  Top 0.152: J3.P2 54.61,39.02 53.63,38.04 53.63,35.95 57.49,32.09 v57.67,32.09
  Bottom 0.152: v57.67,32.09 58.53,32.09 58.6,32.02 58.61,32.02 58.85,31.78 U7.3
J3P3  (via drill 0.35)
  Top 0.152: v58.21,32.83 58.1,32.94 57.07,32.94 53.93,36.08 53.93,37.91 54.64,38.62 J3.P3
  Bottom 0.152: v58.21,32.83 58.3,32.83 58.85,32.28 U7.4
J3P4  (via drill 0.35)
  Top 0.152: J3.P4 54.67,38.22 54.23,37.79 54.23,36.2 56.89,33.55 v57.64,33.55
  Bottom 0.152: v57.64,33.55 57.67,33.58 58.35,33.58 59.15,32.78 U7.5
J3P5  (via drill 0.35)
  Top 0.152: v58.35,35.75 55.12,35.75 54.54,36.33 54.54,36.76 54.54,37.06 54.54,37.66 54.7,37.82 J3.P5
  Bottom 0.152: v58.35,35.75 58.65,36.06 58.8,36.06 59.2,36.46 59.2,37.52 59.34,37.66 U8.2
J3P6  (via drill 0.35)
  Top 0.152: v58.55,36.66 58.3,36.66 57.7,36.07 55.23,36.07 54.9,36.4 54.9,37.23 55.09,37.42 J3.P6
  Bottom 0.152: v58.55,36.66 58.9,37.01 58.9,37.96 58.9,38.02 59.04,38.16 U8.3
J3P7  (via drill 0.35)
  Top 0.152: J3.P7 57.55,36.86 v57.64,36.86
  Bottom 0.152: v57.64,36.86 57.99,37.21 58.24,37.21 58.59,37.56 58.59,38.51 58.74,38.66 U8.4
J3P8  (via drill 0.35)
  Top 0.152: J3.P8 v57.98,37.82 v57.98,37.81
  Bottom 0.152: v57.98,37.81 58.29,38.12 58.29,38.8 58.64,39.16 U8.5
J3P9  (via drill 0.35)
  Top 0.152: v58.84,42.26 58.35,41.77 58.35,39.04 57.53,38.22 J3.P9
  Bottom 0.152: v58.84,42.26 59.04,42.46 59.04,43.86 59.22,44.04 U9.2
J3P10  (via drill 0.35)
  Top 0.152: J3.P10 57.5,38.62 58.05,39.16 58.05,42.77 v58.34,43.06
  Bottom 0.152: v58.34,43.06 58.34,43.86 59.02,44.54 U9.3
J3P11  (via drill 0.35)
  Top 0.152: J3.P11 57.4,39.02 57.74,39.36 57.74,42.66 57.64,42.76 v57.64,43.76
  Bottom 0.152: v57.64,43.76 58.92,45.04 U9.4
J3P12  (via drill 0.35)
  Top 0.152: v57.64,44.76 56.98,44.1 56.98,42.72 57.38,42.32 57.38,39.61 57.19,39.42 J3.P12
  Bottom 0.152: v57.64,44.76 58.42,45.54 U9.5
J4P1  (via drill 0.35)
  Top 0.152: v78.19,31.31 78.08,31.42 77.38,31.42 77.02,31.78 77.02,32.02 73.28,35.77 73.28,38.1 74.54,39.36 J4.P1
  Bottom 0.152: v78.19,31.31 78.19,31.22 U10.2
J4P2  (via drill 0.35)
  Top 0.152: J4.P2 74.57,38.96 73.59,37.98 73.59,35.89 77.45,32.03 v77.63,32.03
  Bottom 0.152: v77.63,32.03 78.49,32.03 78.56,31.96 78.57,31.96 78.81,31.72 U10.3
J4P3  (via drill 0.35)
  Top 0.152: v78.17,32.77 78.06,32.88 77.03,32.88 73.89,36.02 73.89,37.85 74.6,38.56 J4.P3
  Bottom 0.152: v78.17,32.77 78.26,32.77 78.81,32.22 U10.4
J4P4  (via drill 0.35)
  Top 0.152: J4.P4 74.63,38.16 74.19,37.73 74.19,36.14 76.85,33.49 v77.6,33.49
  Bottom 0.152: v77.6,33.49 77.63,33.52 78.31,33.52 79.11,32.72 U10.5
J4P5  (via drill 0.35)
  Top 0.152: v78.31,35.69 75.08,35.69 74.5,36.27 74.5,36.7 74.5,37 74.5,37.6 74.66,37.76 J4.P5
  Bottom 0.152: v78.31,35.69 78.61,36 78.76,36 79.16,36.4 79.16,37.46 79.3,37.6 U11.2
J4P6  (via drill 0.35)
  Top 0.152: v78.51,36.6 78.26,36.6 77.66,36.01 75.19,36.01 74.86,36.34 74.86,37.17 75.05,37.36 J4.P6
  Bottom 0.152: v78.51,36.6 78.86,36.95 78.86,37.9 78.86,37.96 79,38.1 U11.3
J4P7  (via drill 0.35)
  Top 0.152: J4.P7 77.51,36.8 v77.6,36.8
  Bottom 0.152: v77.6,36.8 77.95,37.15 78.2,37.15 78.55,37.5 78.55,38.45 78.7,38.6 U11.4
J4P8  (via drill 0.35)
  Top 0.152: J4.P8 v77.94,37.76 v77.94,37.75
  Bottom 0.152: v77.94,37.75 78.25,38.05 78.25,38.74 78.6,39.1 U11.5
J4P9  (via drill 0.35)
  Top 0.152: v78.8,42.2 78.31,41.71 78.31,38.98 77.49,38.16 J4.P9
  Bottom 0.152: v78.8,42.2 79,42.4 79,43.8 79.18,43.98 U12.2
J4P10  (via drill 0.35)
  Top 0.152: J4.P10 77.46,38.56 78,39.1 78,42.7 v78.3,43
  Bottom 0.152: v78.3,43 78.3,43.8 78.98,44.48 U12.3
J4P11  (via drill 0.35)
  Top 0.152: J4.P11 77.36,38.96 77.7,39.3 77.7,42.6 77.6,42.7 v77.6,43.7
  Bottom 0.152: v77.6,43.7 78.88,44.98 U12.4
J4P12  (via drill 0.35)
  Top 0.152: v77.6,44.7 76.94,44.04 76.94,42.66 77.34,42.26 77.34,39.55 77.15,39.36 J4.P12
  Bottom 0.152: v77.6,44.7 78.38,45.48 U12.5
J5P1  (via drill 0.35)
  Top 0.152: v8.19,11.31 8.08,11.42 7.38,11.42 7.02,11.78 7.02,12.03 3.28,15.77 3.28,18.11 4.54,19.36 J5.P1
  Bottom 0.152: U13.2 8.19,11.22 v8.19,11.31
J5P2  (via drill 0.35)
  Top 0.152: v7.63,12.03 7.45,12.03 3.59,15.89 3.59,17.98 4.57,18.96 J5.P2
  Bottom 0.152: U13.3 8.8,11.72 8.49,12.03 v7.63,12.03
J5P3  (via drill 0.35)
  Top 0.152: v8.17,12.77 8.06,12.88 7.03,12.88 3.89,16.02 3.89,17.85 4.6,18.56 J5.P3
  Bottom 0.152: U13.4 8.81,12.22 8.26,12.77 v8.17,12.77
J5P4  (via drill 0.35)
  Top 0.152: J5.P4 4.63,18.16 4.2,17.73 4.2,16.14 6.85,13.49 v7.6,13.49
  Bottom 0.152: v7.6,13.49 7.63,13.52 8.31,13.52 9.11,12.72 U13.5
J5P5  (via drill 0.35)
  Top 0.152: v8.31,15.69 5.08,15.69 4.5,16.27 4.5,16.7 4.5,17 4.5,17.6 4.66,17.76 J5.P5
  Bottom 0.152: v8.31,15.69 8.61,16 8.76,16 9.16,16.4 9.16,17.46 9.25,17.55 9.3,17.6 U14.2
J5P6  (via drill 0.35)
  Top 0.152: v8.51,16.6 8.21,16.3 8.06,16.3 7.76,16 5.2,16 4.81,16.4 4.81,17.11 5.05,17.36 J5.P6
  Bottom 0.152: v8.51,16.6 8.86,16.95 8.86,17.9 8.86,17.96 9,18.1 U14.3
J5P7  (via drill 0.35)
  Top 0.152: J5.P7 7.51,16.8 v7.6,16.8
  Bottom 0.152: v7.6,16.8 7.95,17.15 8.2,17.15 8.55,17.5 8.55,18.45 8.7,18.6 U14.4
J5P8  (via drill 0.35)
  Top 0.152: J5.P8 v7.94,17.76 v7.95,17.75
  Bottom 0.152: v7.95,17.75 8.25,18.05 8.25,18.75 8.6,19.1 U14.5
J5P9  (via drill 0.35)
  Top 0.152: v8.8,22.2 8.31,21.71 8.31,18.98 7.49,18.16 J5.P9
  Bottom 0.152: v8.8,22.2 9,22.4 9,23.8 9.18,23.98 U15.2
J5P10  (via drill 0.35)
  Top 0.152: J5.P10 7.46,18.56 8.01,19.11 8.01,22.7 v8.3,23
  Bottom 0.152: v8.3,23 8.3,23.8 8.98,24.48 U15.3
J5P11  (via drill 0.35)
  Top 0.152: J5.P11 7.36,18.96 7.7,19.3 7.7,22.6 7.6,22.7 v7.6,23.7
  Bottom 0.152: v7.6,23.7 8.85,24.95 8.88,24.98 U15.4
J5P12  (via drill 0.35)
  Top 0.152: v7.6,24.7 6.94,24.04 6.94,22.66 7.34,22.26 7.34,19.55 7.15,19.36 J5.P12
  Bottom 0.152: v7.6,24.7 8.38,25.48 U15.5
J6P1  (via drill 0.35)
  Top 0.152: v28.19,11.31 28.08,11.42 27.38,11.42 27.02,11.78 27.02,12.03 23.28,15.77 23.28,18.11 24.54,19.36 J6.P1
  Bottom 0.152: v28.19,11.31 28.19,11.22 U16.2
J6P2  (via drill 0.35)
  Top 0.152: J6.P2 24.57,18.96 23.59,17.98 23.59,15.89 27.45,12.03 v27.63,12.03
  Bottom 0.152: v27.63,12.03 28.49,12.03 28.56,11.96 28.57,11.96 28.81,11.72 U16.3
J6P3  (via drill 0.35)
  Top 0.152: v28.17,12.77 28.06,12.88 27.03,12.88 23.89,16.02 23.89,17.85 24.6,18.56 J6.P3
  Bottom 0.152: v28.17,12.77 28.26,12.77 28.81,12.22 U16.4
J6P4  (via drill 0.35)
  Top 0.152: J6.P4 24.63,18.16 24.2,17.73 24.2,16.14 26.85,13.49 v27.6,13.49
  Bottom 0.152: v27.6,13.49 27.63,13.52 28.31,13.52 29.11,12.72 U16.5
J6P5  (via drill 0.35)
  Top 0.152: v28.31,15.69 25.08,15.69 24.5,16.27 24.5,16.7 24.5,17 24.5,17.6 24.66,17.76 J6.P5
  Bottom 0.152: v28.31,15.69 28.61,16 28.76,16 29.16,16.4 29.16,17.46 29.3,17.6 U17.2
J6P6  (via drill 0.35)
  Top 0.152: v28.51,16.6 28.26,16.6 27.66,16.01 25.2,16.01 24.86,16.34 24.86,17.17 25.05,17.36 J6.P6
  Bottom 0.152: 29.4,18.1 29.3,18.1 | 29.3,18.1 29,18.1 28.86,17.96 28.86,17.9 28.86,16.95 v28.51,16.6 | 29.3,18.1 U17.3
J6P7  (via drill 0.35)
  Top 0.152: J6.P7 27.51,16.8 v27.6,16.8
  Bottom 0.152: v27.6,16.8 27.95,17.15 28.2,17.15 28.55,17.5 28.55,18.45 28.7,18.6 U17.4
J6P8  (via drill 0.35)
  Top 0.152: J6.P8 v27.94,17.76 v27.95,17.75
  Bottom 0.152: v27.95,17.75 28.25,18.05 28.25,18.75 28.6,19.1 U17.5
J6P9  (via drill 0.35)
  Top 0.152: v29,22.4 28.31,21.71 28.31,18.98 27.49,18.16 J6.P9
  Bottom 0.152: v29,22.4 29,23.8 29.18,23.98 U18.2
J6P10  (via drill 0.35)
  Top 0.152: J6.P10 27.46,18.56 28.01,19.11 28.01,22.7 v28.3,23
  Bottom 0.152: v28.3,23 28.3,23.8 28.95,24.45 28.98,24.48 U18.3
J6P11  (via drill 0.35)
  Top 0.152: J6.P11 27.36,18.96 27.7,19.3 27.7,22.6 27.6,22.7 v27.6,23.7
  Bottom 0.152: v27.6,23.7 28.85,24.95 28.88,24.98 U18.4
J6P12  (via drill 0.35)
  Top 0.152: v27.7,24.7 26.94,23.94 26.94,22.66 27.34,22.26 27.34,19.55 27.15,19.36 J6.P12
  Bottom 0.152: v27.7,24.7 28.48,25.48 U18.5
J7P1  (via drill 0.35)
  Top 0.152: v68.19,11.31 68.08,11.42 67.38,11.42 67.02,11.78 67.02,12.03 63.28,15.77 63.28,18.11 64.54,19.36 J7.P1
  Bottom 0.152: v68.19,11.31 68.19,11.22 U19.2
J7P2  (via drill 0.35)
  Top 0.152: J7.P2 64.57,18.96 63.59,17.98 63.59,15.89 67.45,12.03 v67.63,12.03
  Bottom 0.152: v67.63,12.03 68.49,12.03 68.56,11.96 68.57,11.96 68.81,11.72 U19.3
J7P3  (via drill 0.35)
  Top 0.152: v68.17,12.77 68.06,12.88 67.03,12.88 63.89,16.02 63.89,17.85 64.6,18.56 J7.P3
  Bottom 0.152: v68.17,12.77 68.26,12.77 68.81,12.22 U19.4
J7P4  (via drill 0.35)
  Top 0.152: J7.P4 64.63,18.16 64.19,17.73 64.19,16.14 66.85,13.49 v67.6,13.49
  Bottom 0.152: v67.6,13.49 67.63,13.52 68.31,13.52 69.11,12.72 U19.5
J7P5  (via drill 0.35)
  Top 0.152: v68.31,15.69 65.08,15.69 64.5,16.27 64.5,16.7 64.5,17 64.5,17.6 64.66,17.76 J7.P5
  Bottom 0.152: v68.31,15.69 68.61,16 68.76,16 69.16,16.4 69.16,17.46 69.3,17.6 U20.2
J7P6  (via drill 0.35)
  Top 0.152: v68.51,16.6 68.26,16.6 67.66,16.01 65.19,16.01 64.86,16.34 64.86,17.17 65.05,17.36 J7.P6
  Bottom 0.152: v68.51,16.6 68.86,16.95 68.86,17.9 68.86,17.96 69,18.1 U20.3
J7P7  (via drill 0.35)
  Top 0.152: J7.P7 67.51,16.8 v67.6,16.8
  Bottom 0.152: v67.6,16.8 67.95,17.15 68.2,17.15 68.55,17.5 68.55,18.45 68.7,18.6 U20.4
J7P8  (via drill 0.35)
  Top 0.152: J7.P8 v67.94,17.76 v67.94,17.75
  Bottom 0.152: v67.94,17.75 68.25,18.05 68.25,18.75 68.6,19.1 U20.5
J7P9  (via drill 0.35)
  Top 0.152: v68.8,22.2 68.31,21.71 68.31,18.98 67.49,18.16 J7.P9
  Bottom 0.152: v68.8,22.2 69,22.4 69,23.8 69.18,23.98 U21.2
J7P10  (via drill 0.35)
  Top 0.152: J7.P10 67.46,18.56 68,19.11 68,22.7 v68.3,23
  Bottom 0.152: v68.3,23 68.3,23.8 68.98,24.48 U21.3
J7P11  (via drill 0.35)
  Top 0.152: J7.P11 67.36,18.96 67.7,19.3 67.7,22.6 67.6,22.7 v67.6,23.7
  Bottom 0.152: v67.6,23.7 68.88,24.98 U21.4
J7P12  (via drill 0.35)
  Top 0.152: v67.6,24.7 66.94,24.04 66.94,22.66 67.34,22.26 67.34,19.55 67.15,19.36 J7.P12
  Bottom 0.152: v67.6,24.7 68.38,25.48 U21.5
J8P1  (via drill 0.35)
  Top 0.152: v48.19,11.31 48.08,11.42 47.38,11.42 47.02,11.78 47.02,12.03 43.28,15.77 43.28,18.11 44.54,19.36 J8.P1
  Bottom 0.152: U22.2 48.19,11.22 v48.19,11.31
J8P2  (via drill 0.35)
  Top 0.152: v47.63,12.03 47.45,12.03 43.59,15.89 43.59,17.98 44.57,18.96 J8.P2
  Bottom 0.152: U22.3 48.81,11.72 48.57,11.96 48.56,11.96 48.49,12.03 v47.63,12.03
J8P3  (via drill 0.35)
  Top 0.152: v48.17,12.77 48.06,12.88 47.03,12.88 43.89,16.02 43.89,17.85 44.6,18.56 J8.P3
  Bottom 0.152: U22.4 48.81,12.22 48.26,12.77 v48.17,12.77
J8P4  (via drill 0.35)
  Top 0.152: v47.6,13.49 46.85,13.49 44.2,16.14 44.2,17.73 44.63,18.16 J8.P4
  Bottom 0.152: v47.6,13.49 47.63,13.52 48.31,13.52 49.11,12.72 U22.5
J8P5  (via drill 0.35)
  Top 0.152: v48.31,15.69 45.08,15.69 44.5,16.27 44.5,16.7 44.5,17 44.5,17.6 44.66,17.76 J8.P5
  Bottom 0.152: U23.2 49.3,17.6 49.16,17.46 49.16,16.4 48.76,16 48.61,16 v48.31,15.69
J8P6  (via drill 0.35)
  Top 0.152: v48.51,16.6 48.26,16.6 47.67,16.01 45.2,16.01 44.86,16.34 44.86,17.07 J8.P6
  Bottom 0.152: U23.3 49.4,18.1 49,18.1 48.86,17.96 48.86,17.9 48.86,16.95 v48.51,16.6
J8P7  (via drill 0.35)
  Top 0.152: v47.6,16.8 47.51,16.8 J8.P7
  Bottom 0.152: U23.4 48.7,18.6 48.55,18.45 48.55,17.5 48.2,17.15 47.95,17.15 v47.6,16.8
J8P8  (via drill 0.35)
  Top 0.152: v47.95,17.75 v47.94,17.76 J8.P8
  Bottom 0.152: U23.5 48.6,19.1 48.25,18.75 48.25,18.05 v47.95,17.75
J8P9  (via drill 0.35)
  Top 0.152: v48.8,22.2 48.31,21.71 48.31,18.98 47.49,18.16 J8.P9
  Bottom 0.152: U24.2 49.18,23.98 49,23.8 49,22.4 v48.8,22.2
J8P10  (via drill 0.35)
  Top 0.152: v48.3,23 48.01,22.7 48.01,19.11 47.46,18.56 J8.P10
  Bottom 0.152: U24.3 48.98,24.48 48.3,23.8 v48.3,23
J8P11  (via drill 0.35)
  Top 0.152: v47.6,23.7 47.6,22.7 47.7,22.6 47.7,19.3 47.36,18.96 J8.P11
  Bottom 0.152: v47.6,23.7 48.88,24.98 U24.4
J8P12  (via drill 0.35)
  Top 0.152: v46.9,22.7 46.94,22.66 47.34,22.26 47.34,19.55 47.15,19.36 J8.P12
  Bottom 0.152: U24.5 48.48,25.48 46.9,23.9 v46.9,22.7
MODE  (via drill 0.35)
  Top 0.406: v23.9,43.2 v23.9,36.9 v23.9,30.5 23.9,27.8 20,23.9 v20,9.3 | v14.1,10.5 v14.1,16.9 14.1,23.2 v14,23.3 15.7,23.3 16.3,22.7 16.3,9.9 19.5,6.7 v19.4,6.7 30.2,6.7 v33.9,10.4 v33.9,16.8 v33.9,23.2 35.3,23.2 35.8,22.7 35.8,9.5 38.5,6.8 50.3,6.8 v53.9,10.4 v53.9,16.7 v53.9,23.2 55.2,23.2 55.7,22.7 55.7,9.4 57.6,7.5 72,7.5 73.9,9.4 v73.9,10.4 v73.9,17.6 v73.9,23.2 | v44.1,43.3 v44.1,36.8 44.1,30.7 | 44.1,30.7 v44.1,30.5 | v63.9,43.2 v63.9,36.9 v63.9,30.6 | v83.8,30.4 v83.8,36.7 v83.8,43.3 83.73,43.37 83.73,46.6 83.08,47.26 77.87,47.26 74.71,44.1 69.43,44.1 v69.4,44.13 68.57,44.13 65.04,47.66 57.86,47.66 47,36.8 47,28.3 45.9,27.2 44.7,27.2 44.5,27.4 | 44.5,27.4 43.4,28.5 43.4,30 44.1,30.7 | 44.5,27.4 44.5,27.41 v44.38,27.54 | v89.3,7.3 90.8,5.8 95.8,5.8 96.8,6.8 96.8,16.8 95.98,17.62 B1.47
  Bottom 0.152: U3.11 22.42,43.98 23.2,43.2 v23.9,43.2 | U2.11 22.4,37.6 23.1,36.9 v23.9,36.9 | U1.11 22.48,31.22 23.2,30.5 v23.9,30.5 | U15.11 12.52,23.98 13.2,23.3 v14,23.3 | U13.11 12.58,11.22 13.3,10.5 v14.1,10.5 | U14.11 12.6,17.6 13.3,16.9 v14.1,16.9 | U18.11 32.52,23.98 33.3,23.2 v33.9,23.2 | v33.9,10.4 33.4,10.4 32.58,11.22 U16.11 | U17.11 32.5,17.6 33.3,16.8 v33.9,16.8 | U6.11 42.66,44.04 43.4,43.3 v44.1,43.3 | v44.1,30.5 43.4,30.5 42.6,31.3 42.07,31.3 U4.11 | U5.11 42.54,37.66 43.4,36.8 v44.1,36.8 | U24.11 52.52,23.98 53.3,23.2 v53.9,23.2 | v53.9,10.4 53.4,10.4 52.58,11.22 U22.11 | U23.11 52.5,17.6 53.4,16.7 v53.9,16.7 | U9.11 62.46,44.04 63.3,43.2 v63.9,43.2 | v63.9,30.6 63.2,30.6 62.52,31.28 U7.11 | U8.11 62.54,37.66 63.3,36.9 v63.9,36.9 | U21.11 72.52,23.98 73.3,23.2 v73.9,23.2 | U19.11 72.48,11.22 73.3,10.4 v73.9,10.4 | U20.11 v73.9,17.6 | U12.11 82.52,43.98 83.2,43.3 v83.8,43.3 | U10.11 82.48,31.22 83.3,30.4 v83.8,30.4 | U11.11 82.4,37.6 83.3,36.7 v83.8,36.7
  Bottom 0.406: v69.4,44.13 68.87,43.6 64.3,43.6 v63.9,43.2 | v44.38,27.54 44.13,27.54 44.08,27.49 42.44,27.49 42.19,27.24 27.59,27.24 25.1,29.73 24.67,29.73 v23.9,30.5 | v20,9.3 20,7.3 v19.4,6.7 | v73.9,10.4 86.2,10.4 v89.3,7.3
N$3  (via drill 0.35)
  other vias: 47.8,14.6
VCC  (via drill 0.35)  (5 unrouted)
  Top 0.2: v21.8,4.8 21.4,5.2 20.6,5.2
  Top 0.406: v24.8,29 v24.8,34.4 v24.8,40.8 25.3,40.8 | v15.1,20.8 v15.1,14.4 15.1,9.2 v15.1,9.1 | v34.7,20.8 v34.7,14.4 v34.7,8.9 | v44.9,29.1 v44.9,34.5 v44.9,40.8 44.83,40.87 44.83,44.1 | v54.7,20.8 v54.7,14.4 v54.7,9 | v64.8,40.9 v64.8,34.5 64.7,34.4 v64.7,29.7 | v74.7,20.8 v74.7,15.3 v74.7,8.9 74.65,8.85 70.8,5 58.6,5 | v84.6,29.6 v84.6,34.4 v84.6,40.8 84.53,40.87 84.53,46.89 83.41,48.02 83.4,48.02 78.9,48.02 77.64,48.02 76.11,46.49 74.62,45 72.9,45 v70.8,45 69.4,45 | 54.7,8.9 v54.7,9 | 54.7,8.8 v54.7,9
  Top 0.813: 44.15,47.12 44.03,47.24 42.28,47.24
  Top 1.016: 78.9,48.25 83.31,48.25 83.47,48.09 | 45.3,41.2 45.3,43.63 44.83,44.1 44.83,44.32 44.67,44.48 44.67,46.65 44.2,47.12 44.15,47.12
  Top 1.27: v21.8,9.4 v21.8,10.2 21.8,24.1 21.8,24.27 25.3,27.77 25.3,40.8 31.84,40.8 38.08,47.04 42.09,47.04 | 39.1,5.2 51.3,5.2 51.31,5.21 54.6,5.21 | 54.7,8.6 v54.7,9 54.7,5.31 54.6,5.21 | 74.75,8.85 71.11,5.21 54.6,5.21 | 45.3,41.2 48.4,41.2 55.5,48.3 57.1,48.3 57.45,48.65 65.75,48.65 69.1,45.3 74.51,45.3 77.46,48.25 78.9,48.25 | 39.1,5.2 | 15.1,9.2 19.1,5.2 20.6,5.2 34.8,5.2 | 39.1,5.2 36.6,5.2 | 36.6,5.2 34.8,5.2 | 34.8,5.2 34.7,5.3 v34.7,8.9 | B1.5V 36.63,5.17 36.6,5.2 | v21.8,5.7 v21.8,4.8
  Bottom 0.152: C12.1 42.34,41.65 42.34,43.25 U6.12 | C11.1 42.34,35.19 42.34,36.87 U5.12 | C10.1 42.34,28.77 42.34,30.49 U4.12 | C46.1 52.3,8.71 52.3,10.43 U22.12 | C47.1 52.3,15.13 52.3,16.81 U23.12 | C48.1 52.3,21.59 52.3,23.19 U24.12 | C28.1 12.3,8.71 12.3,10.43 U13.12 | C29.1 12.3,15.13 12.3,16.81 U14.12 | C30.1 12.3,21.59 12.3,23.19 U15.12 | C4.1 22.3,28.71 22.3,30.43 U1.12 | C5.1 22.3,35.13 22.3,36.81 U2.12 | C6.1 22.3,41.59 22.3,43.19 U3.12 | C16.1 62.34,28.77 62.34,30.49 U7.12 | C17.1 62.34,35.19 62.34,36.87 U8.12 | C18.1 62.34,41.65 62.34,43.25 U9.12 | C22.1 82.3,28.71 82.3,30.43 U10.12 | C23.1 82.3,35.13 82.3,36.81 U11.12 | C24.1 82.3,41.59 82.3,43.19 U12.12 | C34.1 32.3,8.71 32.3,10.43 U16.12 | C35.1 32.3,15.13 32.3,16.81 U17.12 | C36.1 32.3,21.59 32.3,23.19 U18.12 | C40.1 72.3,8.71 72.3,10.43 U19.12 | C41.1 72.3,15.13 72.3,16.81 U20.12 | C42.1 72.3,21.59 72.3,23.19 U21.12
  Bottom 0.406: C6.1 22.67,40.81 22.7,40.83 24.77,40.83 v24.8,40.8 | v24.8,29 23.8,28 C4.1 | v24.8,34.4 v24.79,34.39 23.35,34.39 23.3,34.43 22.7,34.43 22.65,34.39 C5.1 | C30.1 12.77,20.81 12.8,20.83 15.07,20.83 v15.1,20.8 | v15.1,9.1 13.99,7.99 C28.1 | v15.1,14.4 v15.09,14.39 13.55,14.39 13.4,14.53 12.8,14.53 12.65,14.39 C29.1 | C36.1 32.77,20.81 32.8,20.83 34.67,20.83 v34.7,20.8 | v34.7,8.9 33.79,7.99 C34.1 | v34.7,14.4 v34.69,14.39 33.55,14.39 33.4,14.53 32.8,14.53 32.65,14.39 C35.1 | C12.1 41.63,40.8 42.76,40.8 42.9,40.93 43.7,40.93 43.84,40.8 v44.9,40.8 | v44.9,29.1 43.85,28.05 C10.1 | v44.9,34.5 44.85,34.45 43.79,34.45 43.7,34.53 42.9,34.53 42.81,34.45 C11.1 | C48.1 52.77,20.81 52.8,20.83 54.67,20.83 v54.7,20.8 | v54.7,9 53.69,7.99 C46.1 | v54.7,14.4 v54.69,14.39 53.55,14.39 53.4,14.53 52.8,14.53 52.65,14.39 C47.1 | 64.77,40.87 v64.8,40.9 | C18.1 62.73,40.87 62.8,40.93 63.4,40.93 63.47,40.87 64.77,40.87 | v64.7,29.7 63.15,28.05 C16.1 | v64.8,34.5 64.75,34.45 63.49,34.45 63.4,34.53 62.8,34.53 62.71,34.45 C17.1 | C42.1 72.77,20.81 72.8,20.83 74.67,20.83 v74.7,20.8 | v74.7,8.9 73.79,7.99 C40.1 | C41.1 72.65,14.39 73.56,15.3 v74.7,15.3 | C24.1 82.67,40.81 82.7,40.83 84.57,40.83 v84.6,40.8 | v84.6,29.6 82.99,27.99 C22.1 | v84.6,34.4 v84.59,34.39 83.35,34.39 83.3,34.43 82.7,34.43 82.65,34.39 C23.1 | v70.8,45 70.2,44.4 70.2,42.5 68.57,40.87 64.77,40.87
  Bottom 1.27: 21.8,10.6 v21.8,10.2 v21.8,9.4 v21.8,5.7 21.8,4.9
VM  (via drill 0.35)  (5 unrouted)
  Top 0.152: v24.6,25.2 25.5,25.2 | 25.2,25.17 v25.2,24.6 25.5,24.9 v25.5,25.4 v26.1,24.8
  Top 0.406: v19.2,41.2 19.2,36.95 19.24,36.91 19.24,36.3 19.2,36.26 v19.2,35.2 v19.2,29.4 13.1,29.4 12.25,28.55 | v9.1,9.4 v9.1,15.1 9.1,16.16 9.24,16.3 9.24,16.91 9.1,17.05 v9.1,21.3 10.4,22.6 10.5,22.7 | v39.2,41.4 39.2,37.05 39.28,36.97 39.28,36.36 39.2,36.28 v39.2,35.4 | v39.2,29.4 39.2,30.4 | v49.2,9.4 v49.2,15.5 49.2,16.26 49.24,16.3 49.24,21.15 v49.1,21.29 | v59.1,41.35 59.1,41.3 | 59.1,41.3 59.1,37.15 59.28,36.97 59.28,36.36 59.1,36.18 v59.1,35.2 v59.1,29.5 | v69.1,21.3 69.1,17.05 69.24,16.91 69.24,10.06 v69.3,10 | v79.1,41.29 79.1,37.05 79.24,36.91 79.24,36.3 79.1,36.16 v79.1,35.1 v79.1,30 | v29,9.4 29,15.35 29.24,15.59 29.24,16.91 29,17.15 v29,21.29 30.8,23.09 30.8,27.1 31.25,27.55 32,28.3 31.8,28.5 31.1,29.2 29.5,29.2 | 59.1,41.48 59.1,41.3 | v39.2,29.4 40.4,28.2 41.4,28.2 43.86,25.74 46.33,25.74 | 38.5,29.4 v39.2,29.4
  Top 1.016: 45.98,25.2 45.45,24.67 | 50.5,32.3 55,32.3 57.8,29.5 v59.1,29.5 59.46,29.5
  Top 1.27: 59.46,29.5 60.5,28.46 66.76,28.46 68.3,30 78.2,30 v79.1,30 79.7,30.6 79.7,41.4 | 49.33,25.8 51,25.8 | 51,25.8 51.8,25.8 52.57,26.57 55.57,26.57 58.97,23.17 58.97,17.73 66.83,9.87 69.07,9.87 69.67,10.47 69.67,17.09 69.6,17.16 69.6,21.1 69.7,21.2 | 45.98,25.2 46.09,25.31 47.21,25.31 47.7,25.8 48.4,25.8 49.33,25.8 | v19.2,29.4 19.9,30.1 19.9,41.3 | 59.61,41.39 59.61,37.25 59.71,37.15 59.71,30.11 v59.1,29.5 | 55,32.3 51.55,32.3 51.48,32.37 50.52,32.37 49.33,31.18 49.33,25.8 | 51,25.8 51,22.75 49.32,21.07 49.32,17.44 49.67,17.09 49.67,9.87 v49.2,9.4 | 12.25,28.55 10.5,26.8 10.5,22.7 | 10.4,22.6 9.97,22.17 9.97,21.72 9.8,21.55 9.8,9.7 9.4,9.7 v9.1,9.4 | 31.25,27.55 31.25,22.35 29.7,20.8 29.7,9.6 29.2,9.6 v29,9.4 | 39.2,30.4 39.2,30.69 39.4,30.88 39.4,35.15 39.71,35.47 39.71,37.15 39.41,37.45 39.41,41.19
  Top 2.54: v19.2,29.4 6.4,29.4 | 32,28.3 32.2,28.5 37.6,28.5 38.5,29.4 | v39.2,29.4 39.2,28.95 43.48,24.67 45.45,24.67 46.03,24.67 | v25.2,24.6 25.9,25.3 25.9,25.45 28.95,28.5 31.8,28.5
  Bottom 0.152: U6.1 39.95,42.77 C9.1 | U4.1 39.95,29.99 C7.1 | U22.1 49.91,9.93 C43.1 | U23.1 49.91,16.25 C44.1 | U24.1 49.91,22.71 C45.1 | U13.1 9.91,9.93 C25.1 | U14.1 9.91,16.25 C26.1 | U15.1 9.91,22.71 C27.1 | U1.1 19.91,29.93 C1.1 | U2.1 19.91,36.25 C2.1 | U3.1 19.91,42.71 C3.1 | U7.1 59.95,29.99 C13.1 | U8.1 59.95,36.31 C14.1 | U9.1 59.95,42.77 C15.1 | U10.1 79.91,29.93 C19.1 | U11.1 79.91,36.25 C20.1 | U12.1 79.91,42.71 C21.1 | U16.1 29.91,9.93 C31.1 | U17.1 29.91,16.25 C32.1 | U18.1 29.91,22.71 C33.1 | U19.1 69.91,9.93 C37.1 | U20.1 69.91,16.25 C38.1 | U21.1 69.91,22.71 C39.1 | v25.2,24.6 25.4,24.8 v26.1,24.8 25.8,24.5 v25.8,24 | v19,28.3 18.4,28.9 v18.3,28.9 | v18.3,28.9 18,29.2 v17.4,29.2 17.4,28.4 v17.5,28.3 | v18.2,29.9 18.3,29.8 v18.3,28.9 | v18.3,28.9 18.7,28.9 v19.2,29.4 | C8.1 39.95,36.31 U5.1
  Bottom 0.406: C3.1 20.24,42.24 19.65,41.65 v19.2,41.2 | C1.1 v19.21,29.41 v19.2,29.4 19.2,27.4 22,24.6 23.1,24.6 v25.2,24.6 | C2.1 19.71,35.81 19.2,35.3 v19.2,35.2 | C27.1 10.14,22 9.8,22 v9.1,21.3 | C26.1 10.24,15.7 9.7,15.7 v9.1,15.1 | C25.1 v9.11,9.41 v9.1,9.4 | C9.1 40.1,42.3 v39.2,41.4 | C8.1 39.67,35.87 v39.2,35.4 | C7.1 39.27,29.47 v39.2,29.4 | C45.1 50.05,22.24 v49.1,21.29 | v49.2,9.4 C43.1 | C44.1 49.51,15.81 v49.2,15.5 | C15.1 60.05,42.3 v59.1,41.35 | v59.1,29.5 60.44,29.5 C13.1 | C14.1 59.77,35.87 v59.1,35.2 | C39.1 70.24,22.1 69.8,22.1 69.1,21.4 v69.1,21.3 | C38.1 69.74,15.2 v69.1,15.2 | C37.1 69.89,9.41 v69.3,10 | C21.1 80.14,42.24 79.19,41.29 v79.1,41.29 | C20.1 79.81,35.81 v79.1,35.1 | C33.1 30.14,22 29.8,22 29.09,21.29 v29,21.29 | v29,9.4 C31.1 | C32.1 30.14,15.6 29.8,15.6 29.3,15.1 v29.2,15.1 | C19.1 79.63,29.41 79.1,29.94 v79.1,30
  Bottom 2.54: v25.2,24.6 23.9,23.3 21.4,23.3 18.2,26.5 18.2,29.2